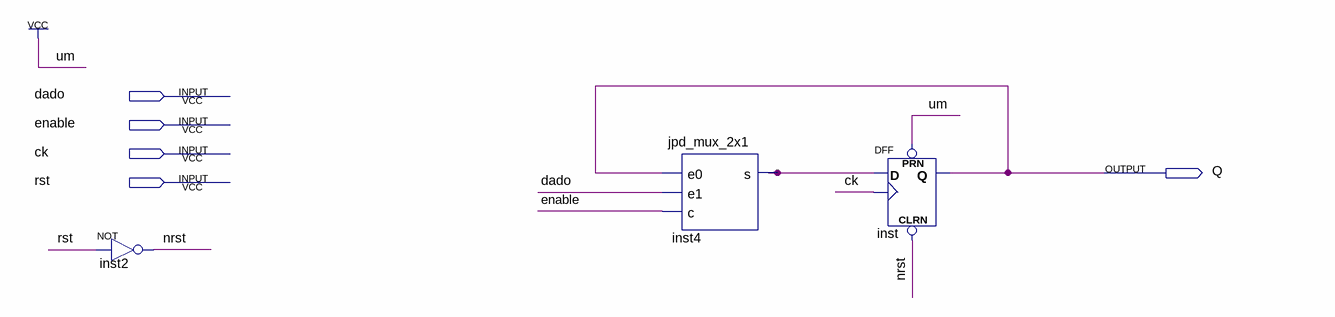
[diagram p0: schematic sheet]
// Quartus schematic jpd_reg_1bit.bdf as structural Verilog: 3 symbols, 5 pins
module jpd_reg_1bit (
  input  dado,
  input  enable,
  input  ck,
  input  rst,
  output Q
);

  wire inst4_s, nrst;

  not inst2 (nrst, rst);
  jpd_mux_2x1 inst4 (.e0(Q), .e1(dado), .c(enable), .s(inst4_s));
  DFF inst (.CLRN(nrst), .CLK(ck), .D(inst4_s), .PRN(1'b1), .Q(Q));
endmodule
